# Altium schematic sheet HAL_2.SchDoc
size A
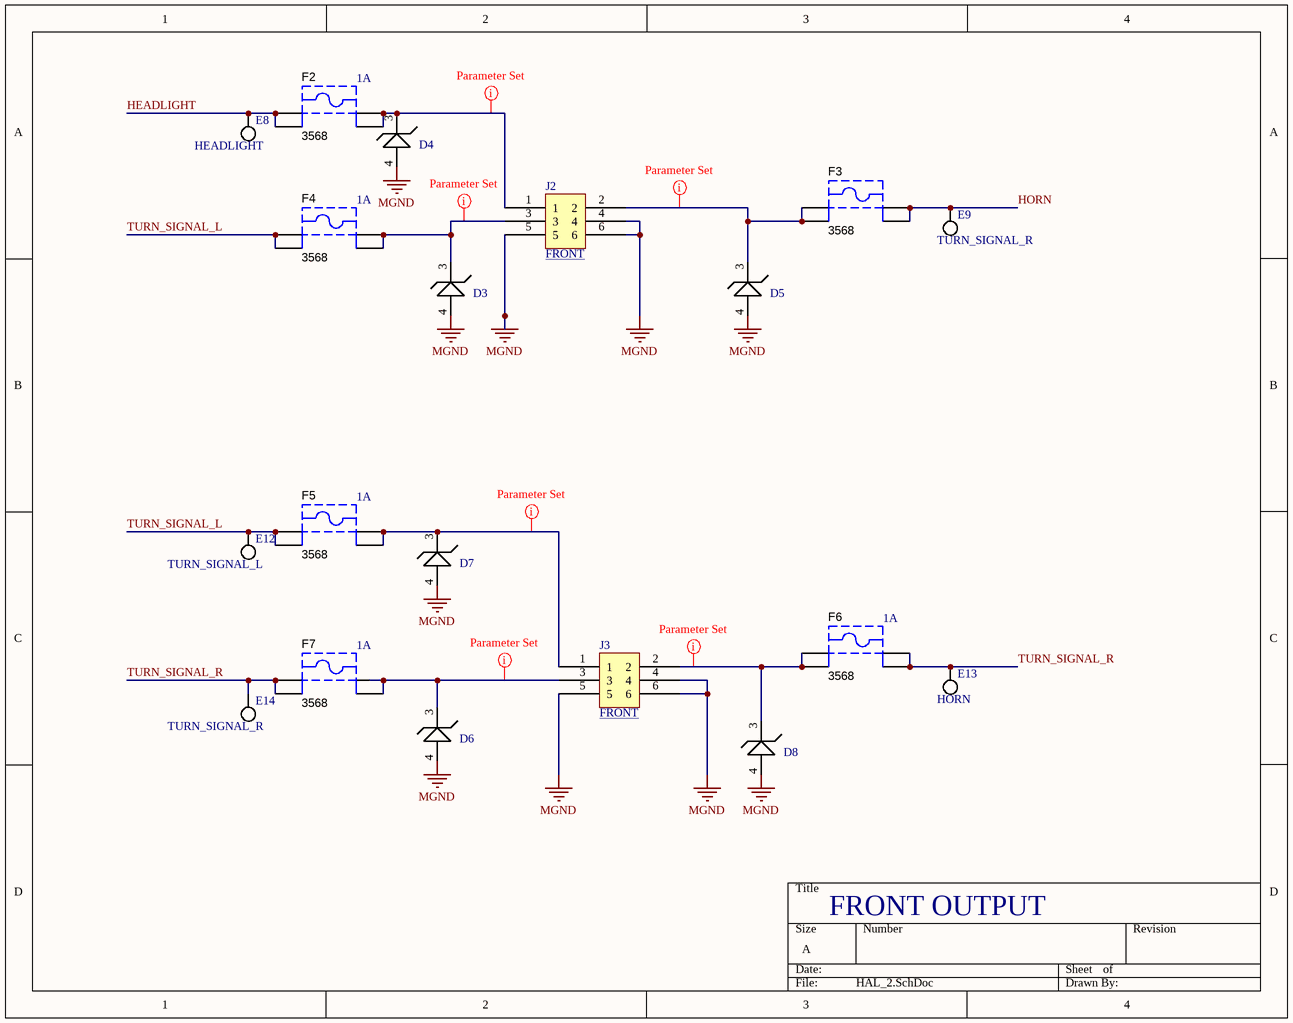
[diagram p0: HAL_2.SchDoc]

## Parts
D3  TVS DIODE 12.4V 20.1V DO219AB  [TVS DIODE 12.4V 20.1V DO219AB]  (value not drawn)
D4  TVS DIODE 12.4V 20.1V DO219AB  [TVS DIODE 12.4V 20.1V DO219AB]  (value not drawn)
D5  TVS DIODE 12.4V 20.1V DO219AB  [TVS DIODE 12.4V 20.1V DO219AB]  (value not drawn)
D6  TVS DIODE 12.4V 20.1V DO219AB  [TVS DIODE 12.4V 20.1V DO219AB]  (value not drawn)
D7  TVS DIODE 12.4V 20.1V DO219AB  [TVS DIODE 12.4V 20.1V DO219AB]  (value not drawn)
D8  TVS DIODE 12.4V 20.1V DO219AB  [TVS DIODE 12.4V 20.1V DO219AB]  (value not drawn)
E8  HEADLIGHT  [EPAD]  (no BOM)
E9  TURN_SIGNAL_R  [EPAD]  (no BOM)
E12  TURN_SIGNAL_L  [EPAD]  (no BOM)
E13  HORN  [EPAD]  (no BOM)
E14  TURN_SIGNAL_R  [EPAD]  (no BOM)
F2  3568  [KSTN-3568_V]
F3  3568  [KSTN-3568_V]
F4  3568  [KSTN-3568_V]
F5  3568  [KSTN-3568_V]
F6  3568  [KSTN-3568_V]
F7  3568  [KSTN-3568_V]
J2  FRONT  [PCBComponent_1 - duplicate]
J3  FRONT  [PCBComponent_1 - duplicate]

## Nets
MGND: D3.4 D4.4 D5.4 D6.4 D7.4 D8.4 J2.4 J2.5 J2.6 J3.4 J3.5 J3.6
HEADLIGHT: E8.1 F2.1 F2.2
HORN: E9.1 F3.3 F3.4
TURN_SIGNAL_L: E12.1 F4.1 F4.2 F5.1 F5.2
TURN_SIGNAL_R: E13.1 E14.1 F6.3 F6.4 F7.1 F7.2
NetD3_3: D3.3 F4.3 F4.4 J2.3
NetD4_3: D4.3 F2.3 F2.4 J2.1
NetD5_3: D5.3 F3.1 F3.2 J2.2
NetD6_3: D6.3 F7.3 F7.4 J3.3
NetD7_3: D7.3 F5.3 F5.4 J3.1
NetD8_3: D8.3 F6.1 F6.2 J3.2

## Layout directives
rule Width Constraint [Pref Width = 70mil    Min Width = 70mil    Max Width = 70mil]: NetD3_3, NetD4_3, NetD5_3, NetD6_3, NetD7_3, NetD8_3

## Notes on the sheet
- (near F2) 1A
- (near F4) 1A
- (near F5) 1A
- (near F6) 1A
- (near F7) 1A
- FRONT OUTPUT

## Library data of the parts
E8 E9 E12-E14 = EPAD: Pad for probing signals
F2-F7 = CMP-2000-05464-1: Fuse Holder, 20 A, 500 V, -50 to 145 degC, 4-Pin THD, RoHS; Manufacturer: Keystone; Package Reference: 3568; Datasheet Version: 04/2013; Datasheet URL: https://datasheet.ciiva.com/16294/m60-2p40-16294706.pdf; Manufacturer URL: http://www.keyelco.com/; Mounting Technology: ThroughHole; Package Description: 4-Pin Through Hole Device, Body 16 x 6.73 mm, Pitch 9.9 mm
J2 J3 = 6 pin Megafit: 768250006-https://www.digikey.com/en/products/detail/molex/0768250006/5639613?s=N4IgTCBcDaIOwDYAcYCsAGTCQF0C%2BQA; ComponentLink1Description: New link; ComponentLink1URL: *https://www.digikey.com/en/products/detail/molex/0768250006/5639613?s=N4IgTCBcDaIOwDYAcYCsAGTCQF0C%2BQA
D3-D8 = TVS DIODE 12.4V 20.1V DO219AB: ComponentLink1Description: Digikey; ComponentLink1URL: https://www.digikey.com/product-detail/en/vishay-semiconductor-diodes-division/VTVS12ASMF-M3-08/112-VTVS12ASMF-M3-08CT-ND/7055981; ComponentLink2Description: Datasheet; ComponentLink2URL: http://www.vishay.com/docs/85891/vtvs3v3asmf.pdf